# Altium schematic sheet Adafruit Trellis 4x4 3mm HT16K33.SchDoc: Adafruit Trellis 4x4 3mm HT16K33
size 270 x 207 mm; Date: 8/26/2016 7:53:33 AM; SheetNumber: 1
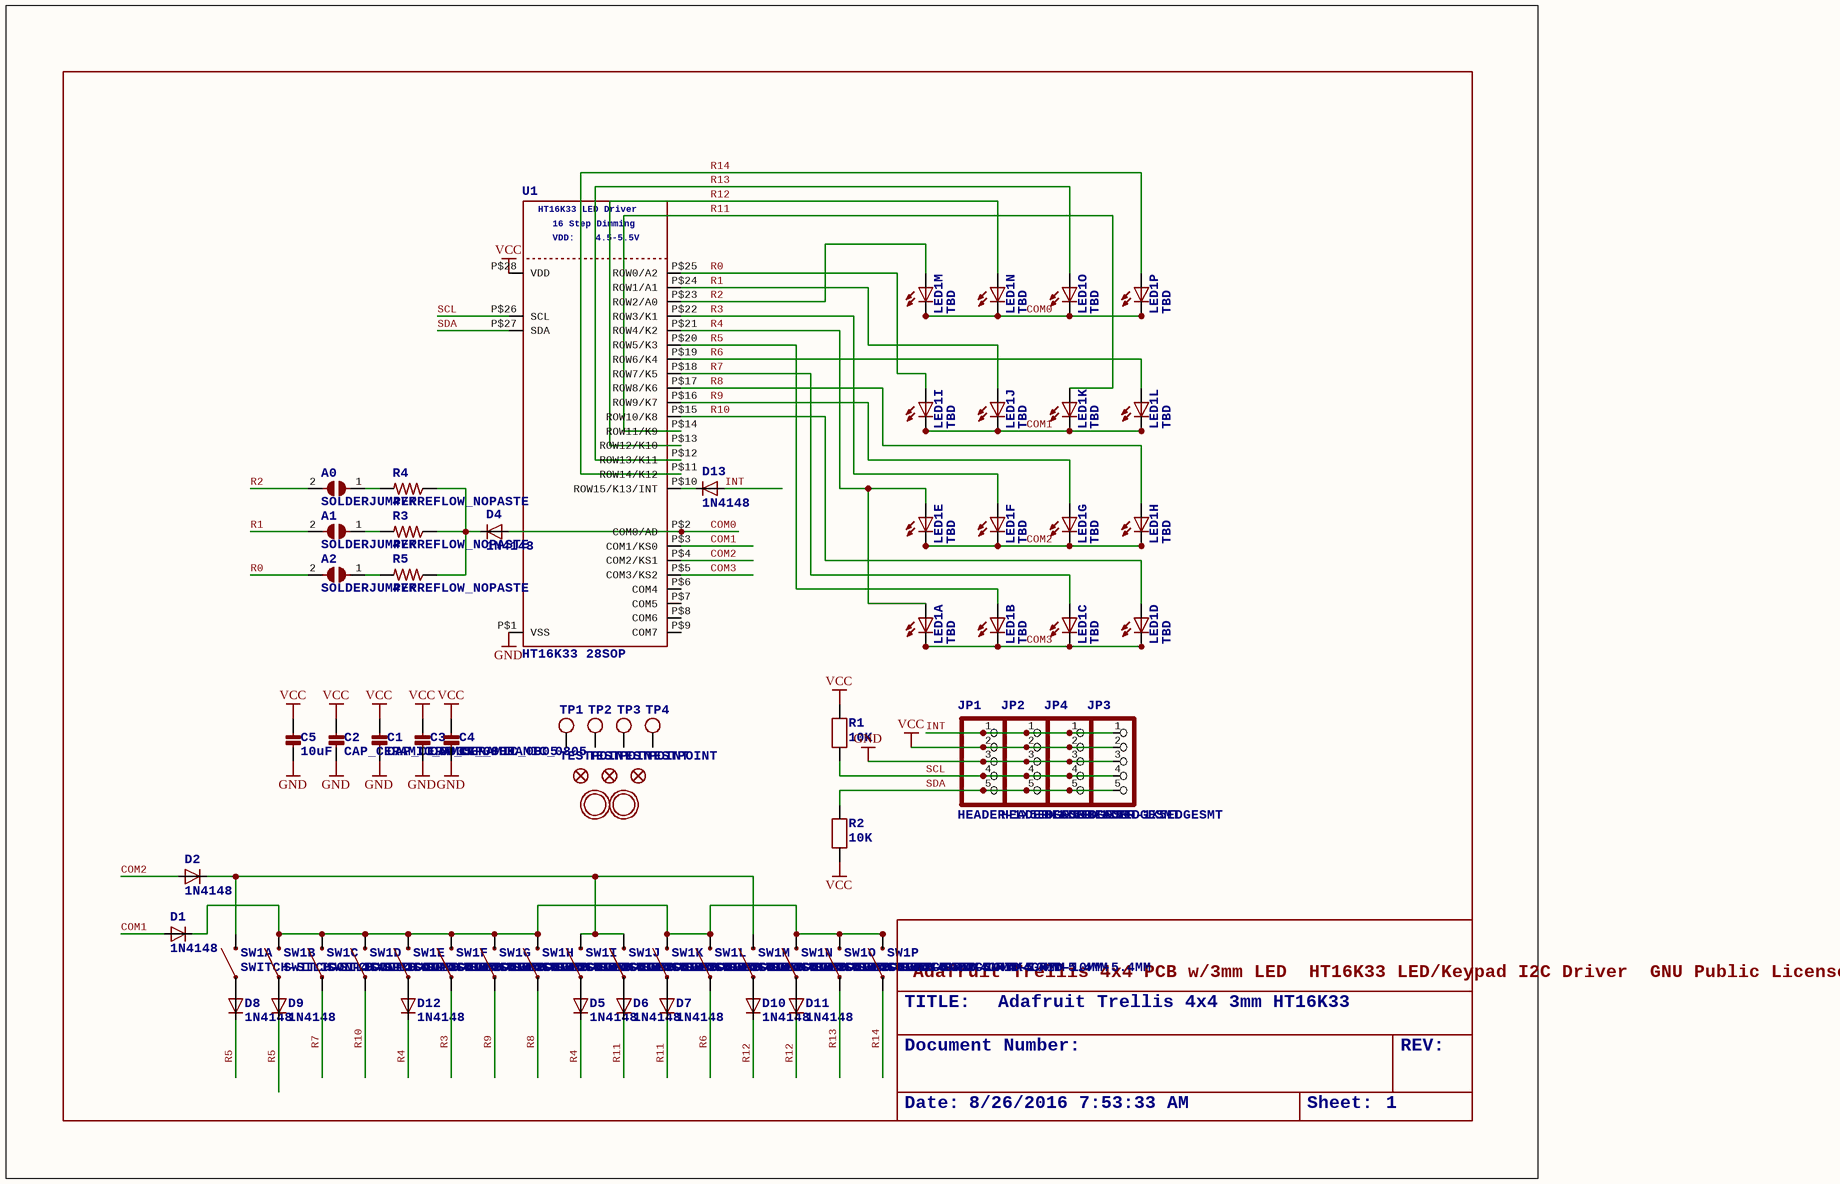
[diagram p0: Adafruit Trellis 4x4 3mm HT16K33.SchDoc]

## Parts
A0  SOLDERJUMPERREFLOW_NOPASTE  [SOLDERJUMPER_REFLOW_NOPASTE]
A1  SOLDERJUMPERREFLOW_NOPASTE  [SOLDERJUMPER_REFLOW_NOPASTE]
A2  SOLDERJUMPERREFLOW_NOPASTE  [SOLDERJUMPER_REFLOW_NOPASTE]
C1  CAP_CERAMIC_0805  [_0805]
C2  CAP_CERAMIC_0805  [_0805]
C3  CAP_CERAMIC_0805  [_0805]
C4  CAP_CERAMIC_0805  [_0805]
C5  10uF  [_0805]
D1  1N4148  [SOD-323]
D2  1N4148  [SOD-323]
D4  1N4148  [SOD-323F]
D5  1N4148  [SOD-323]
D6  1N4148  [SOD-323]
D7  1N4148  [SOD-323]
D8  1N4148  [SOD-323]
D9  1N4148  [SOD-323]
D10  1N4148  [SOD-323]
D11  1N4148  [SOD-323]
D12  1N4148  [SOD-323]
D13  1N4148  [SOD-323]
FID1  FIDUCIAL""  [FIDUCIAL_1MM]  (value not drawn)
FID2  FIDUCIAL""  [FIDUCIAL_1MM]  (value not drawn)
FID3  FIDUCIAL""  [FIDUCIAL_1MM]  (value not drawn)
JP1  HEADER-1X5EDGESMT  [1X5_SMT]
JP2  HEADER-1X5EDGESMT  [1X5_SMT]
JP3  HEADER-1X5EDGESMT  [1X5_SMT]
JP4  HEADER-1X5EDGESMT  [1X5_SMT]
LED1  TBD  [LED3MM-4X4GRID]  (parts A,B,C,D,E,F,G,H,I,J,K,L,M,N,O,P of 16)
R1  10K  [_0805]
R2  10K  [_0805]
R3  47K  [R0805]
R4  47K  [R0805]
R5  47K  [R0805]
SW1  SWITCH-SILICON-4X4GRID-10MM-5.4MM  [ELAST_PAD_SQUARE_10MM_5.4MM_4X4GRID]  (parts A,B,C,D,E,F,G,H,I,J,K,L,M,N,O,P of 16)
TP1  TESTPOINT  [TESTPOINT_SMT]
TP2  TESTPOINT  [TESTPOINT_SMT]
TP3  TESTPOINT  [TESTPOINT_SMT]
TP4  TESTPOINT  [TESTPOINT_SMT]
U1  HT16K33 28SOP  HT16K33LEDDriver: HT16K33 LED Driver  VDD: VDD:  16StepDimming: 16 Step Dimming  [SOP28_300MIL]
U$1  MOUNTINGHOLE2.5  [MOUNTINGHOLE_2.5_PLATED]  (value not drawn)
U$2  MOUNTINGHOLE2.5  [MOUNTINGHOLE_2.5_PLATED]  (value not drawn)

## Nets
GND: C1.1 C2.1 C3.1 C4.1 C5.1 JP1.3 JP2.3 JP3.3 JP4.3 U1.P$1(VSS)
VCC: C1.2 C2.2 C3.2 C4.2 C5.2 JP1.2 JP2.2 JP3.2 JP4.2 R1.2 R2.1 U1.P$28(VDD)
COM0: D4.A LED1.K13(C) LED1.K14(C) LED1.K15(C) LED1.K16(C) U1.P$2(COM0/AD)
COM1: D1.A LED1.K9(C) LED1.K10(C) LED1.K11(C) LED1.K12(C) U1.P$3(COM1/KS0)
COM2: D2.A LED1.K5(C) LED1.K6(C) LED1.K7(C) LED1.K8(C) U1.P$4(COM2/KS1)
COM3: LED1.K1(C) LED1.K2(C) LED1.K3(C) LED1.K4(C) U1.P$5(COM3/KS2)
INT: D13.A JP1.1 JP2.1 JP3.1 JP4.1
R0: A2.2 LED1.A9(A) U1.P$25(ROW0/A2)
R1: A1.2 LED1.A10(A) U1.P$24(ROW1/A1)
R2: A0.2 LED1.A13(A) U1.P$23(ROW2/A0)
R3: LED1.A6(A) SW1.A6(P$1) U1.P$22(ROW3/K1)
R4: D5.C D12.C LED1.A1(A) LED1.A5(A) U1.P$21(ROW4/K2)
R5: D8.C D9.C LED1.A2(A) U1.P$20(ROW5/K3)
R6: LED1.A12(A) SW1.A12(P$1) U1.P$19(ROW6/K4)
R7: LED1.A3(A) SW1.A3(P$1) U1.P$18(ROW7/K5)
R8: LED1.A8(A) SW1.A8(P$1) U1.P$17(ROW8/K6)
R9: LED1.A7(A) SW1.A7(P$1) U1.P$16(ROW9/K7)
R10: LED1.A4(A) SW1.A4(P$1) U1.P$15(ROW10/K8)
R11: D6.C D7.C LED1.A11(A) U1.P$14(ROW11/K9)
R12: D10.C D11.C LED1.A14(A) U1.P$13(ROW12/K10)
R13: LED1.A15(A) SW1.A15(P$1) U1.P$12(ROW13/K11)
R14: LED1.A16(A) SW1.A16(P$1) U1.P$11(ROW14/K12)
SCL: JP1.4 JP2.4 JP3.4 JP4.4 R1.1 U1.P$26(SCL)
SDA: JP1.5 JP2.5 JP3.5 JP4.5 R2.2 U1.P$27(SDA)
NetA0_1: A0.1 R4.2
NetA1_1: A1.1 R3.2
NetA2_1: A2.1 R5.2
NetD1_C: D1.C SW1.B2(P$2) SW1.B3(P$2) SW1.B4(P$2) SW1.B5(P$2) SW1.B6(P$2) SW1.B7(P$2) SW1.B8(P$2) SW1.B11(P$2) SW1.B12(P$2) SW1.B14(P$2) SW1.B15(P$2) SW1.B16(P$2)
NetD2_C: D2.C SW1.B1(P$2) SW1.B9(P$2) SW1.B10(P$2) SW1.B13(P$2)
NetD4_C: D4.C R3.1 R4.1 R5.1
NetD5_A: D5.A SW1.A9(P$1)
NetD6_A: D6.A SW1.A10(P$1)
NetD7_A: D7.A SW1.A11(P$1)
NetD8_A: D8.A SW1.A1(P$1)
NetD9_A: D9.A SW1.A2(P$1)
NetD10_A: D10.A SW1.A13(P$1)
NetD11_A: D11.A SW1.A14(P$1)
NetD12_A: D12.A SW1.A5(P$1)
NetD13_C: D13.C U1.P$10(ROW15/K13/INT)

Not connected (* = marked no-connect by the designer): TP1 P$1; TP2 P$1; TP3 P$1; TP4 P$1; U1 P$6(COM4) P$7(COM5) P$8(COM6) P$9(COM7)

## Notes on the sheet
- (near SW1) Adafruit Trellis 4x4 PCB w/3mm LED
  HT16K33 LED/Keypad I2C Driver
  GNU Public License v2
- (near SW1) TITLE:
- Document Number:
- Adafruit Trellis 4x4 3mm HT16K33
- REV:
- Date:
- 8/26/2016 7:53:33 AM
- Sheet:
- 1

## Library data of the parts
A0-A2 = SOLDERJUMPERREFLOW_NOPASTE: SMD Solder JUMPER   Solder the two pads together to create a connection, or remove the solder to break it.REFLOW - Use this footprint for solder paste and reflow ovens. WAVE - Use this footprint for hand-soldering (larger pads).    CLOSED - Has a trace between the two pads to ensure it is closed by default.  The trace needs to be cut to disable the jumper, and can be closed again by creating a solder bridge between the two pads.
C1-C5 = CAP_CERAMIC_0805: Ceramic Capacitors   For new designs, use the packages preceded by an '_' character since they are more reliable:   The following footprints should be used on most boards: _0402 - Standard footprint for regular board layouts  _0603 - Standard footprint for regular board layouts  _0805 - Standard footprint for regular board layouts  _1206 - Standard footprint for regular board layouts       For extremely tight-pitch boards where space is at a premium, the following 'micro-pitch' footprints can be used (smaller pads, no silkscreen outline, etc.): _0402MP - Micro-pitch footprint for very dense/compact boards  _0603MP - Micro-pitch footprint for very dense/compact boards  _0805MP - Micro-pitch footprint for very dense/compact boards  _1206MP - Micro-pitch footprint for very dense/compact boards
D1 D2 D5-D13 = DIODESOD-323: Diode    SMA      Model	  Volts	  Amps	  Type	  Vf	  Ir	  Digikey #	  Notes	     SSA34-E3	  40V	  3A	  Schottky	  480mV @ 3A	  200uA @ 40V	  SSA34-E3/61TGITR-ND	  	     CDBA120-G	  20V	  1A	  Schottky	  500mV @ 1A	  500uA @ 20V	  641-1014-6-ND	  REEL	     MBRA210	  10V	  2A	  Schottky	  350mV @ 2A	  700uA @ 10V	  MBRA210LT3	  	 SOD-123      Model	  Volts	  Amps	  Type	  Vf	  Ir	  Order #	  Notes	     BAT54T1G	  30V	  200mA	  Schottky	  800mV @ 200mA	  2uA @ 25V	  BAT54T1GOSTR-ND	  	     B0530W	  30V	  500mA	  Schottky	  430mV @ 500mA	  130uA @ 30V	  B0530W-FDICT-ND	  REEL	     MBR120	  20V	  1A	  Schottky	  340mV @ 1A	  	  MBR120VLSFT1GOSCT-ND	  	 SOD-323      Model	  Volts	  Amps	  Type	  Vf	  Ir	  Order #	  Notes	     PMEG2005EJ	  20V	  500mA	  Schottky	  355mV @ 500mA	  	  568-4110-1-ND	  	     ZLLS410	  10V	  570mA	  Schottky	  380mV @ 570mA	  	  ZLLS410CT-ND	  	     1N4148WS	  75V	  150mA	  Silicon/Simple	  1V	  	  1N4148WSFSCT-ND	  REEL	 SOD-523      Model	  Volts	  Amps	  Type	  Vf	  Ir	  Order #	  Notes	     BAT54XV2	  30V	  200mA	  Schottky	  0.8V @ 100mA	  	  BAT54XV2CT-ND	  	     TB751S	  30V	  30mA	  Schottky	  	  	  RB751S-40TE61CT-ND	  	 SOT23-R/W (R = Solder Paste/Reflow Ovens, W = Hand-Soldering)       Model	  Volts	  Amps	  Type	  Vf	  Ir	  Order #	  Notes	     BAT54FILM	  40V	  300mA	  Schottky	  	  	  497-7162-1-ND	  	 POWERDI-5       Model	  Volts	  Amps	  Type	  Vf	  Ir	  Order #	  Notes	     PDS560	  60V	  5A	  Schottky	  670mV @ 5A	  150uA @ 60V	  PDS560DICT-ND
D4 = DIODESOD-323F: Diode   SMADIODE - SMA Surface Mount Package  20V 1A Schottky Diode Digikey: 641-1014-6-ND    DO-1N4148 - Through Hole Small Current Diode SOD-123 20V 1 A (.5mV Vf) Schottky Diode - Digikey: MBRX120TPMSCT-ND    SOD-323 10V 570mA (.38mV Vf, 3ns) Schottky Diode - Digikey: ZLLS410CT-ND    SOD-523 30V 30mA Schottky Diode (RB751S-40TE61) - Digikey: RB751S-40TE61CT-ND    SOT23-R/W - SOT23 Package (R = Solder Paste/Reflow Ovens, W = Hand-Soldering)  BAT54Film 40V 300mA - Digikey: 497-7162-1-ND
FID1-FID3 = FIDUCIAL"": Fiducial Alignment Points   Various fiducial points for machine vision alignment.; BOM: EXCLUDE
JP1-JP4 = HEADER-1X5EDGESMT: PIN HEADER
LED1 = LED-3MM-4X4GRID-3MM
R1 R2 = RESISTOR_0805: Resistors   For new designs, use the packages preceded by an '_' character since they are more reliable:   The following footprints should be used on most boards: _0402 - Standard footprint for regular board layouts  _0603 - Standard footprint for regular board layouts  _0805 - Standard footprint for regular board layouts  _1206 - Standard footprint for regular board layouts       For extremely tight-pitch boards where space is at a premium, the following 'micro-pitch' footprints can be used (smaller pads, no silkscreen outline, etc.): _0402MP - Micro-pitch footprint for very dense/compact boards  _0603MP - Micro-pitch footprint for very dense/compact boards  _0805MP - Micro-pitch footprint for very dense/compact boards  _1206MP - Micro-pitch footprint for very dense/compact boards
R3-R5 = R-US_R0805: RESISTOR, American symbol
TP1-TP4 = TESTPOINT: Test Point   Various test points for characterisation and PCB testing    TESTPOINT_SMT - Compact Surface Mount Test Point [Digikey: 5016KTR-ND]
U1 = HT16K33_SOP28: 4.5-5.5V: 4.5-5.5V
U$1 U$2 = MOUNTINGHOLE2.5: Mounting Hole   For #2 screws (0.086"/2.18mm width, 0.094"/2.4mm hole) use 2.5mm; BOM: EXCLUDE